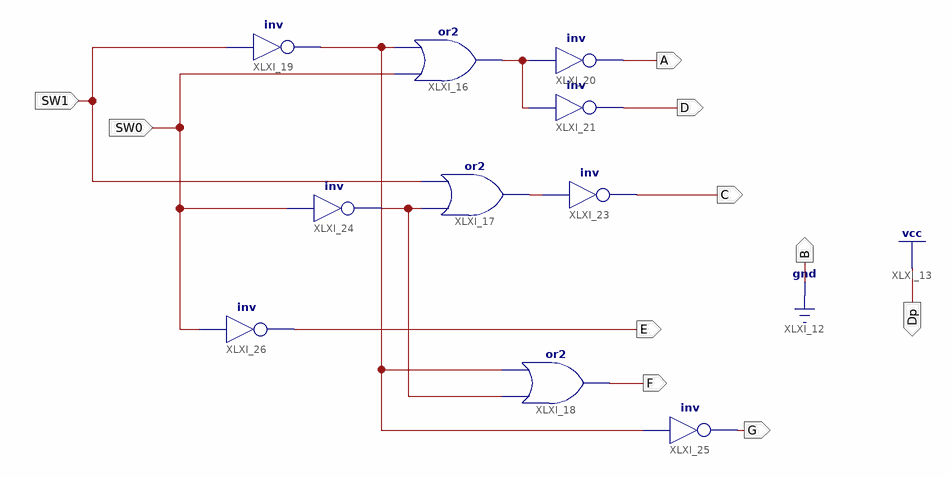
[diagram p0: schematic sheet 1]
// Xilinx ISE schematic SW_7SEG.sch (spartan6) as structural Verilog: 10 symbols, 10 ports
module SW_7SEG (
  input  SW1,
  input  SW0,
  output F,
  output C,
  output B,
  output Dp,
  output A,
  output D,
  output G,
  output E
);

  wire jj, XLXN_43, XLXN_45, XLXN_46;

  or XLXI_17 (XLXN_45, XLXN_46, SW1);
  or XLXI_18 (F, XLXN_46, jj);
  not XLXI_19 (jj, SW1);
  not XLXI_20 (A, XLXN_43);
  not XLXI_21 (D, XLXN_43);
  or XLXI_16 (XLXN_43, SW0, jj);
  not XLXI_23 (C, XLXN_45);
  not XLXI_24 (XLXN_46, SW0);
  not XLXI_25 (G, jj);
  not XLXI_26 (E, SW0);

  assign B = 1'b0;
  assign Dp = 1'b1;
endmodule
